# EAGLE schematic Display-Board_Rack-PDU_3.0 (EAGLE 9.2.1)
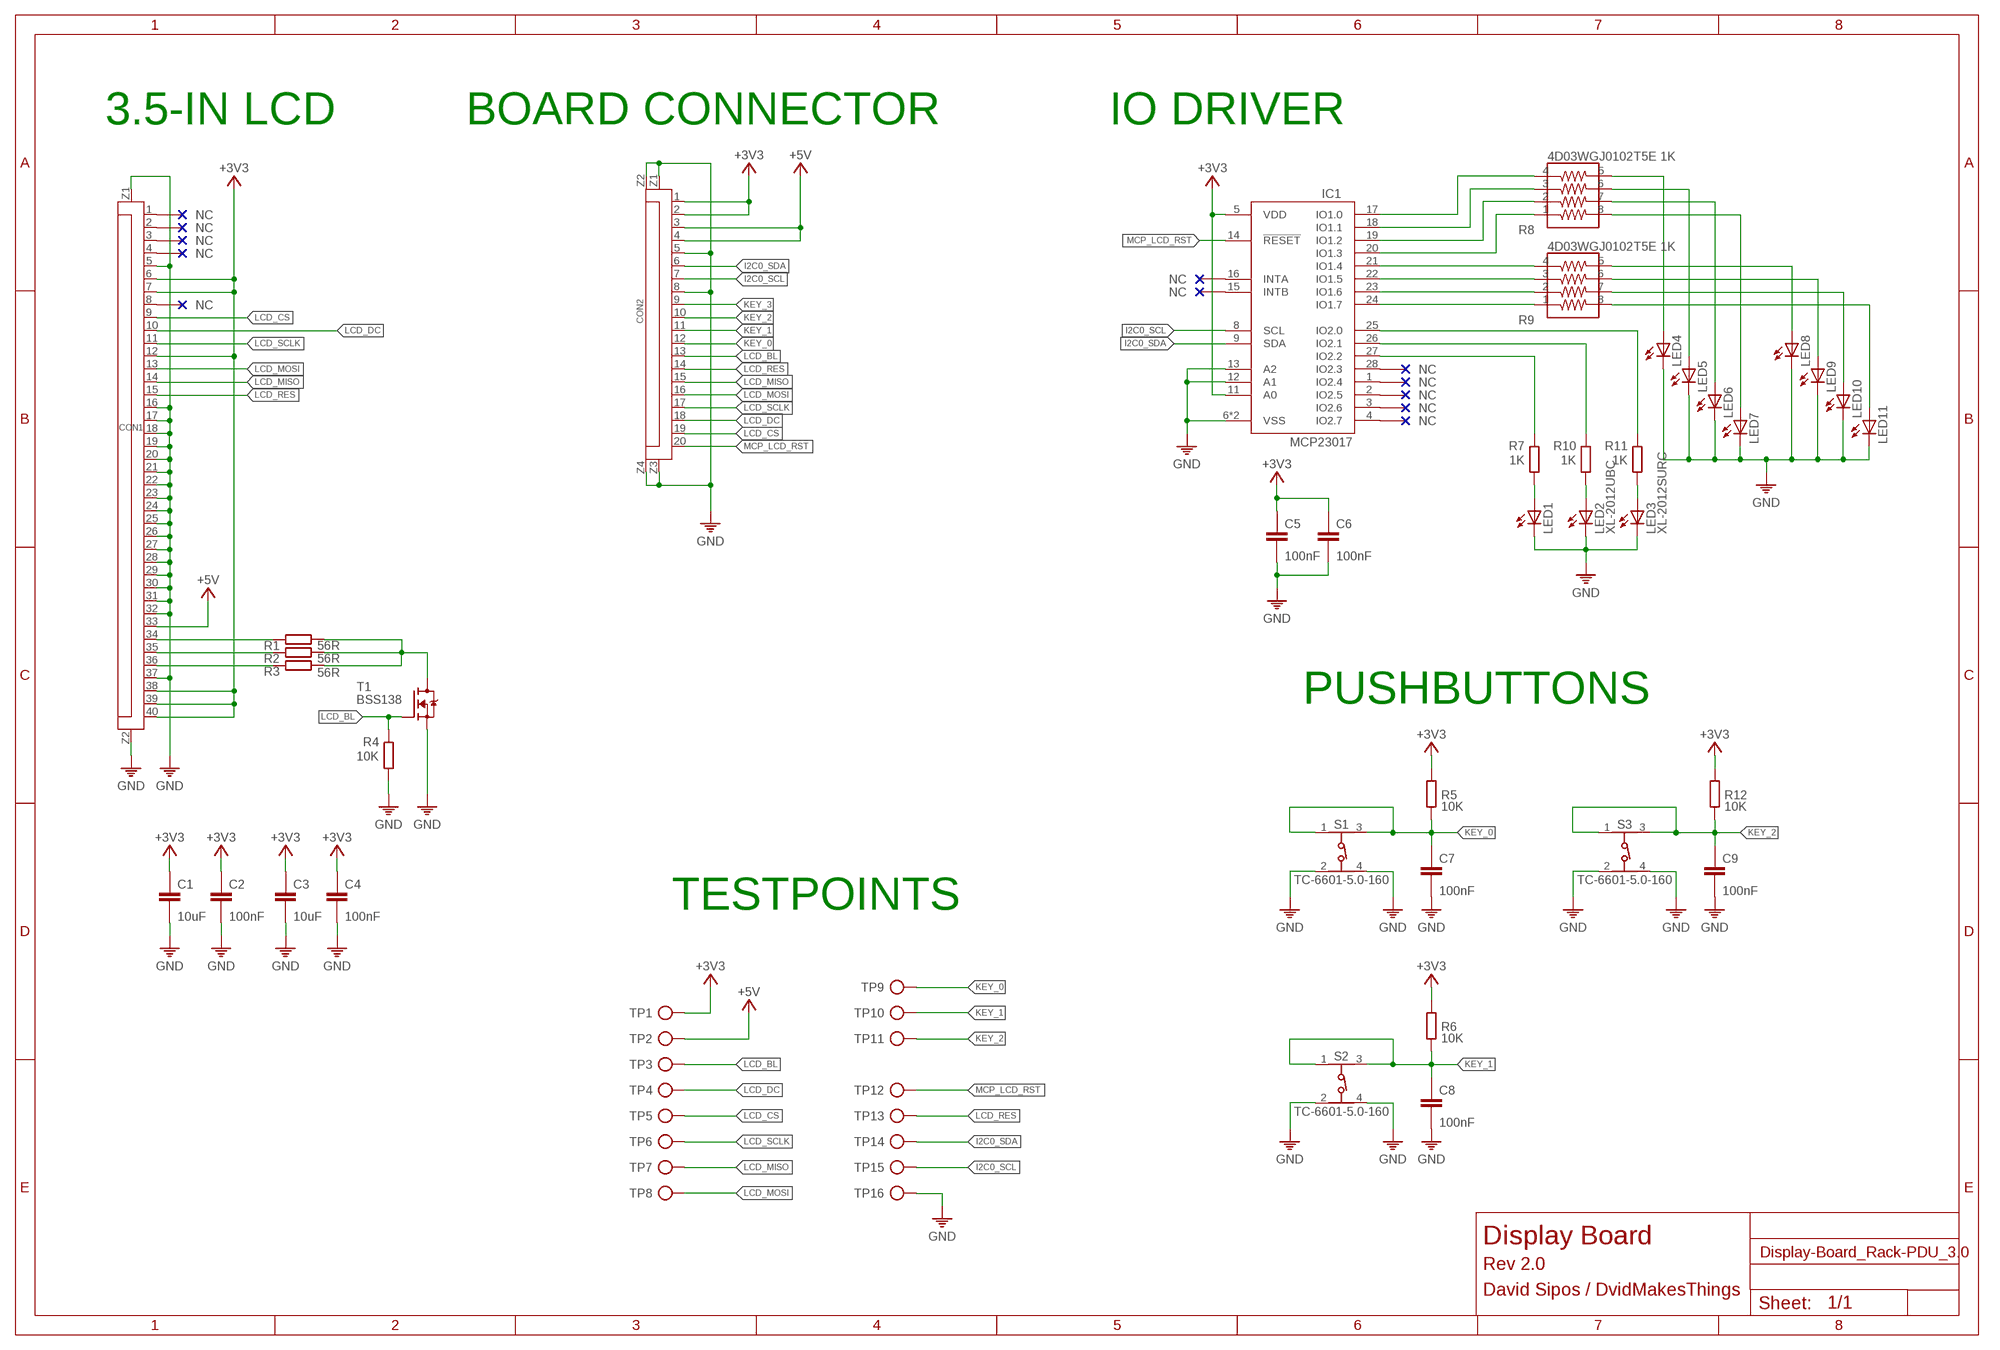
[diagram p0: schematic, sheet 1]

## Parts
C1  10uF  C-0402  [C0402]
C2  100nF  C-0402  [C0402]
C3  10uF  C-0402  [C0402]
C4  100nF  C-0402  [C0402]
C5  100nF  C-0402  [C0402]
C6  100nF  C-0402  [C0402]
C7  100nF  C-0402  [C0402]
C8  100nF  C-0402  [C0402]
C9  100nF  C-0402  [C0402]
CON1  FPC40-HD  [FPC40_3.5TFT]
CON2  FPC20-H  [FPC20]
IC1  MCP23017-E/ML  [QFN28[6X6]ML]
LED1  LEDCHIP-LED0805  [CHIP-LED0805]
LED2  XL-2012UBC  LEDCHIP-LED0805  [CHIP-LED0805]
LED3  XL-2012SURC  LEDCHIP-LED0805  [CHIP-LED0805]
LED4  LEDCHIP-LED0805  [CHIP-LED0805]
LED5  LEDCHIP-LED0805  [CHIP-LED0805]
LED6  LEDCHIP-LED0805  [CHIP-LED0805]
LED7  LEDCHIP-LED0805  [CHIP-LED0805]
LED8  LEDCHIP-LED0805  [CHIP-LED0805]
LED9  LEDCHIP-LED0805  [CHIP-LED0805]
LED10  LEDCHIP-LED0805  [CHIP-LED0805]
LED11  LEDCHIP-LED0805  [CHIP-LED0805]
R1  56R  R0402  [0402]
R2  56R  R0402  [0402]
R3  56R  R0402  [0402]
R4  10K  R0402  [0402]
R5  10K  R0402  [0402]
R6  10K  R0402  [0402]
R7  1K  R0402  [0402]
R8  4D03WGJ0102T5E 1K  742C083103JP  [742C083103JP]
R9  4D03WGJ0102T5E 1K  742C083103JP  [742C083103JP]
R10  1K  R0402  [0402]
R11  1K  R0402  [0402]
R12  10K  R0402  [0402]
S1  TC-6601-5.0-160  430182043816  [430182043816]
S2  TC-6601-5.0-160  430182043816  [430182043816]
S3  TC-6601-5.0-160  430182043816  [430182043816]
T1  BSS138  [SOT23]
TP1  TP  [TP]
TP2  TP  [TP]
TP3  TP  [TP]
TP4  TP  [TP]
TP5  TP  [TP]
TP6  TP  [TP]
TP7  TP  [TP]
TP8  TP  [TP]
TP9  TP  [TP]
TP10  TP  [TP]
TP11  TP  [TP]
TP12  TP  [TP]
TP13  TP  [TP]
TP14  TP  [TP]
TP15  TP  [TP]
TP16  TP  [TP]

## Nets
+3V3: C1.1 C2.1 C3.1 C4.1 C5.1 C6.1 CON1.6 CON1.7 CON1.12 CON1.38 CON1.39 CON1.40 CON2.1 CON2.2 IC1.5(VDD) IC1.11(A0) R5.1 R6.1 R12.1 TP1.TP
+5V: CON1.33 CON2.3 CON2.4 TP2.TP
GND: C1.2 C2.2 C3.2 C4.2 C5.2 C6.2 C7.2 C8.2 C9.2 CON1.5 CON1.16 CON1.17 CON1.18 CON1.19 CON1.20 CON1.21 CON1.22 CON1.23 CON1.24 CON1.25 CON1.26 CON1.27 CON1.28 CON1.29 CON1.30 CON1.31 CON1.32 CON1.37 CON1.Z1 CON1.Z2 CON2.5 CON2.8 CON2.Z1 CON2.Z2 CON2.Z3 CON2.Z4 IC1.6(VSS) IC1.12(A1) IC1.13(A2) IC1.PAD(VSS) LED1.C LED2.C LED3.C LED4.C LED5.C LED6.C LED7.C LED8.C LED9.C LED10.C LED11.C R4.2 S1.2 S1.4 S2.2 S2.4 S3.2 S3.4 T1.2(S) TP16.TP
I2C0_SCL: CON2.7 IC1.8(SCL) TP15.TP
I2C0_SDA: CON2.6 IC1.9(SDA) TP14.TP
KEY_0: C7.1 CON2.12 R5.2 S1.1 S1.3 TP9.TP
KEY_1: C8.1 CON2.11 R6.2 S2.1 S2.3 TP10.TP
KEY_2: C9.1 CON2.10 R12.2 S3.1 S3.3 TP11.TP
KEY_3: CON2.9
LCD_BL: CON2.13 R4.1 T1.1(G) TP3.TP
LCD_CS: CON1.9 CON2.19 TP5.TP
LCD_DC: CON1.10 CON2.18 TP4.TP
LCD_MISO: CON1.14 CON2.15 TP7.TP
LCD_MOSI: CON1.13 CON2.16 TP8.TP
LCD_RES: CON1.15 CON2.14 TP13.TP
LCD_SCLK: CON1.11 CON2.17 TP6.TP
MCP_LCD_RST: CON2.20 IC1.14(!RESET) TP12.TP
N$2: CON1.35 R2.2
N$3: CON1.36 R3.2
N$4: R1.1 R2.1 R3.1 T1.3(D)
N$5: CON1.34 R1.2
N$46: IC1.26(IO2.1) R10.1
N$47: IC1.27(IO2.2) R7.1
N$48: IC1.25(IO2.0) R11.1
N$50: IC1.17(IO1.0) R8.4
N$51: IC1.18(IO1.1) R8.3
N$52: IC1.19(IO1.2) R8.2
N$53: IC1.20(IO1.3) R8.1
N$54: IC1.21(IO1.4) R9.4
N$55: IC1.22(IO1.5) R9.3
N$56: IC1.23(IO1.6) R9.2
N$57: IC1.24(IO1.7) R9.1
N$58: LED4.A R8.5
N$59: LED5.A R8.6
N$60: LED6.A R8.7
N$61: LED7.A R8.8
N$62: LED8.A R9.5
N$63: LED9.A R9.6
N$64: LED10.A R9.7
N$65: LED11.A R9.8
N$66: LED3.A R11.2
N$67: LED2.A R10.2
N$68: LED1.A R7.2
Unconnected: CON1.1 CON1.2 CON1.3 CON1.4 CON1.8 IC1.1(IO2.4) IC1.2(IO2.5) IC1.3(IO2.6) IC1.4(IO2.7) IC1.15(INTB) IC1.16(INTA) IC1.28(IO2.3)

## Notes on the sheet
- 3.5-IN LCD | BOARD CONNECTOR | IO DRIVER
- PUSHBUTTONS
- TESTPOINTS
- Display Board
- Rev 2.0
- David Sipos / DvidMakesThings

## Library data of the parts
C1-C9 = ds_passive:C
CON1 = ds_con:FPC40-H
CON2 = ds_con:FPC20-H
IC1 = ds_ic_peripherals:MCP23017: 16-Bit I2C I/O Expander with Serial Interface
LED1-LED11 = led:LED: LED OSRAM: - CHIPLED LG R971, LG N971, LY N971, LG Q971, LY Q971, LO R971, LY R971 LH N974, LH R974 LS Q976, LO Q976, LY Q976 LO Q996 - Hyper CHIPLED LW Q18S LB Q993, LB Q99A, LB R99A - SideLED LS A670, LO A670, LY A670, LG A670, LP A670 LB A673, LV A673, LT A673, LW A673 LH A674 LY A675 LS A676, LA A676, LO A676, LY A676, LW A676 LS A679, LY A679, LG A679 - Hyper Micro SIDELED® LS Y876, LA Y876, LO Y876, LY Y876 LT Y87S - SmartLED LW L88C, LW L88S LB L89C, LB L89S, LG L890 LS L89K, LO L89K, LY L89K LS L896, LA L896, LO L896, LY L896 - TOPLED LS T670, LO T670, LY T670, LG T670, LP T670 LSG T670, LSP T670, LSY T670, LOP T670, LYG T670 LG T671, LOG T671, LSG T671 LB T673, LV T673, LT T673, LW T673 LH T674 LS T676, LA T676, LO T676, LY T676, LB T676, LH T676, LSB T676, LW T676 LB T67C, LV T67C, LT T67C, LS T67K, LO T67K, LY T67K, LW E67C LS E67B, LA E67B, LO E67B, LY E67B, LB E67C, LV E67C, LT E67C LW T67C LS T679, LY T679, LG T679 LS T770, LO T770, LY T770, LG T770, LP T770 LB T773, LV T773, LT T773, LW T773 LH T774 LS E675, LA E675, LY E675, LS T675 LS T776, LA T776, LO T776, LY T776, LB T776 LHGB T686 LT T68C, LB T68C - Hyper Mini TOPLED® LB M676 - Mini TOPLED Santana® LG M470 LS M47K, LO M47K, LY M47K Source: http://www.osram.convergy.de LUXEON: - LUMILED® LXK2-PW12-R00, LXK2-PW12-S00, LXK2-PW14-U00, LXK2-PW14-V00 LXK2-PM12-R00, LXK2-PM12-S00, LXK2-PM14-U00 LXK2-PE12-Q00, LXK2-PE12-R00, LXK2-PE12-S00, LXK2-PE14-T00, LXK2-PE14-U00 LXK2-PB12-K00, LXK2-PB12-L00, LXK2-PB12-M00, LXK2-PB14-N00, LXK2-PB14-P00, LXK2-PB14-Q00 LXK2-PR12-L00, LXK2-PR12-M00, LXK2-PR14-Q00, LXK2-PR14-R00 LXK2-PD12-Q00, LXK2-PD12-R00, LXK2-PD12-S00 LXK2-PH12-R00, LXK2-PH12-S00 LXK2-PL12-P00, LXK2-PL12-Q00, LXK2-PL12-R00 Source: www.luxeon.com KINGBRIGHT: KA-3528ASYC Source: www.kingbright.com
R1-R7 R10-R12 = ds_passive:R
R8 R9 = Resistor Array:742C083103JP: RES ARRAY 4 RES 10K OHM 1206 Manufacturer's datasheet <https://www.ctscorp.com/wp-content/uploads/74x.pdf>; CREATED_BY: PCBLayout.com; DIGIKEY_PN: 742C083103JPTR-ND; MANUFACTURER: CTS Resistor Products; MPN: 742C083103JP; PACKAGE: 1206
S1-S3 = Wurth_Switch_WS-TASV:430182043816: WS-TASV SMT Tact Switch 6x6 mm Material Properties Cover Material : Stainless Steel Properties Actuator Material:LCP Actuator Flammability :UL94 V-0 Rating Actuator Color:Black; Salmon; White Frame Material:LCP Flammability Rating:UL94 V-0 Frame Color:Black Contact Material:Stainless Steel Contact Plating:Silver Terminal Material:Copper Alloy Terminal Plating:Silver VR:12 V (DC) Contact Resistance Initial:100 mΩ Contact Resistance After Life Test:2Ω RISO:100 MΩ Withstanding Voltage:250 V (AC) Washable:No Qty.:4000;5000 Mechanical Properties Electrical Life:400; 550; 1000 Stroke :0.25 mm General Information Operating Temperature:-40 up to +85 °C Washable:No Packaging Properties Packaging:Tape and Reel <https://www.we-online.com/catalog/media/o37470v209%20Family_WS-TASV_6x6mm_SMD_Tact_Switch_4301820xx8xx.jpg> Details see: https://www.we-online.com/catalog/en/TASV_6X6_SMD/ Updated by yingchun,Shan;2020-02-18 2020(C) Würth Elektronik; DATASHEET-URL: https://www.we-online.com/redexpert/spec/430182043816?ae; HEIGHT: 4.3mm; OPERATION-FORCE: 160g; PART-NUMBER: 430182043816; QTY: 1000; VALUE: 430182043816
T1 = transistor-fet:BSS138: N-Channel Logic Level Enhancement Mode Field Effect Transistor
TP1-TP16 = ds_passive:TP

## Net classes
0 default: width 0.2 mm, drill 0.35 mm, clearance 0.191 mm